# Altium project filament-width-sensor.PrjPcb
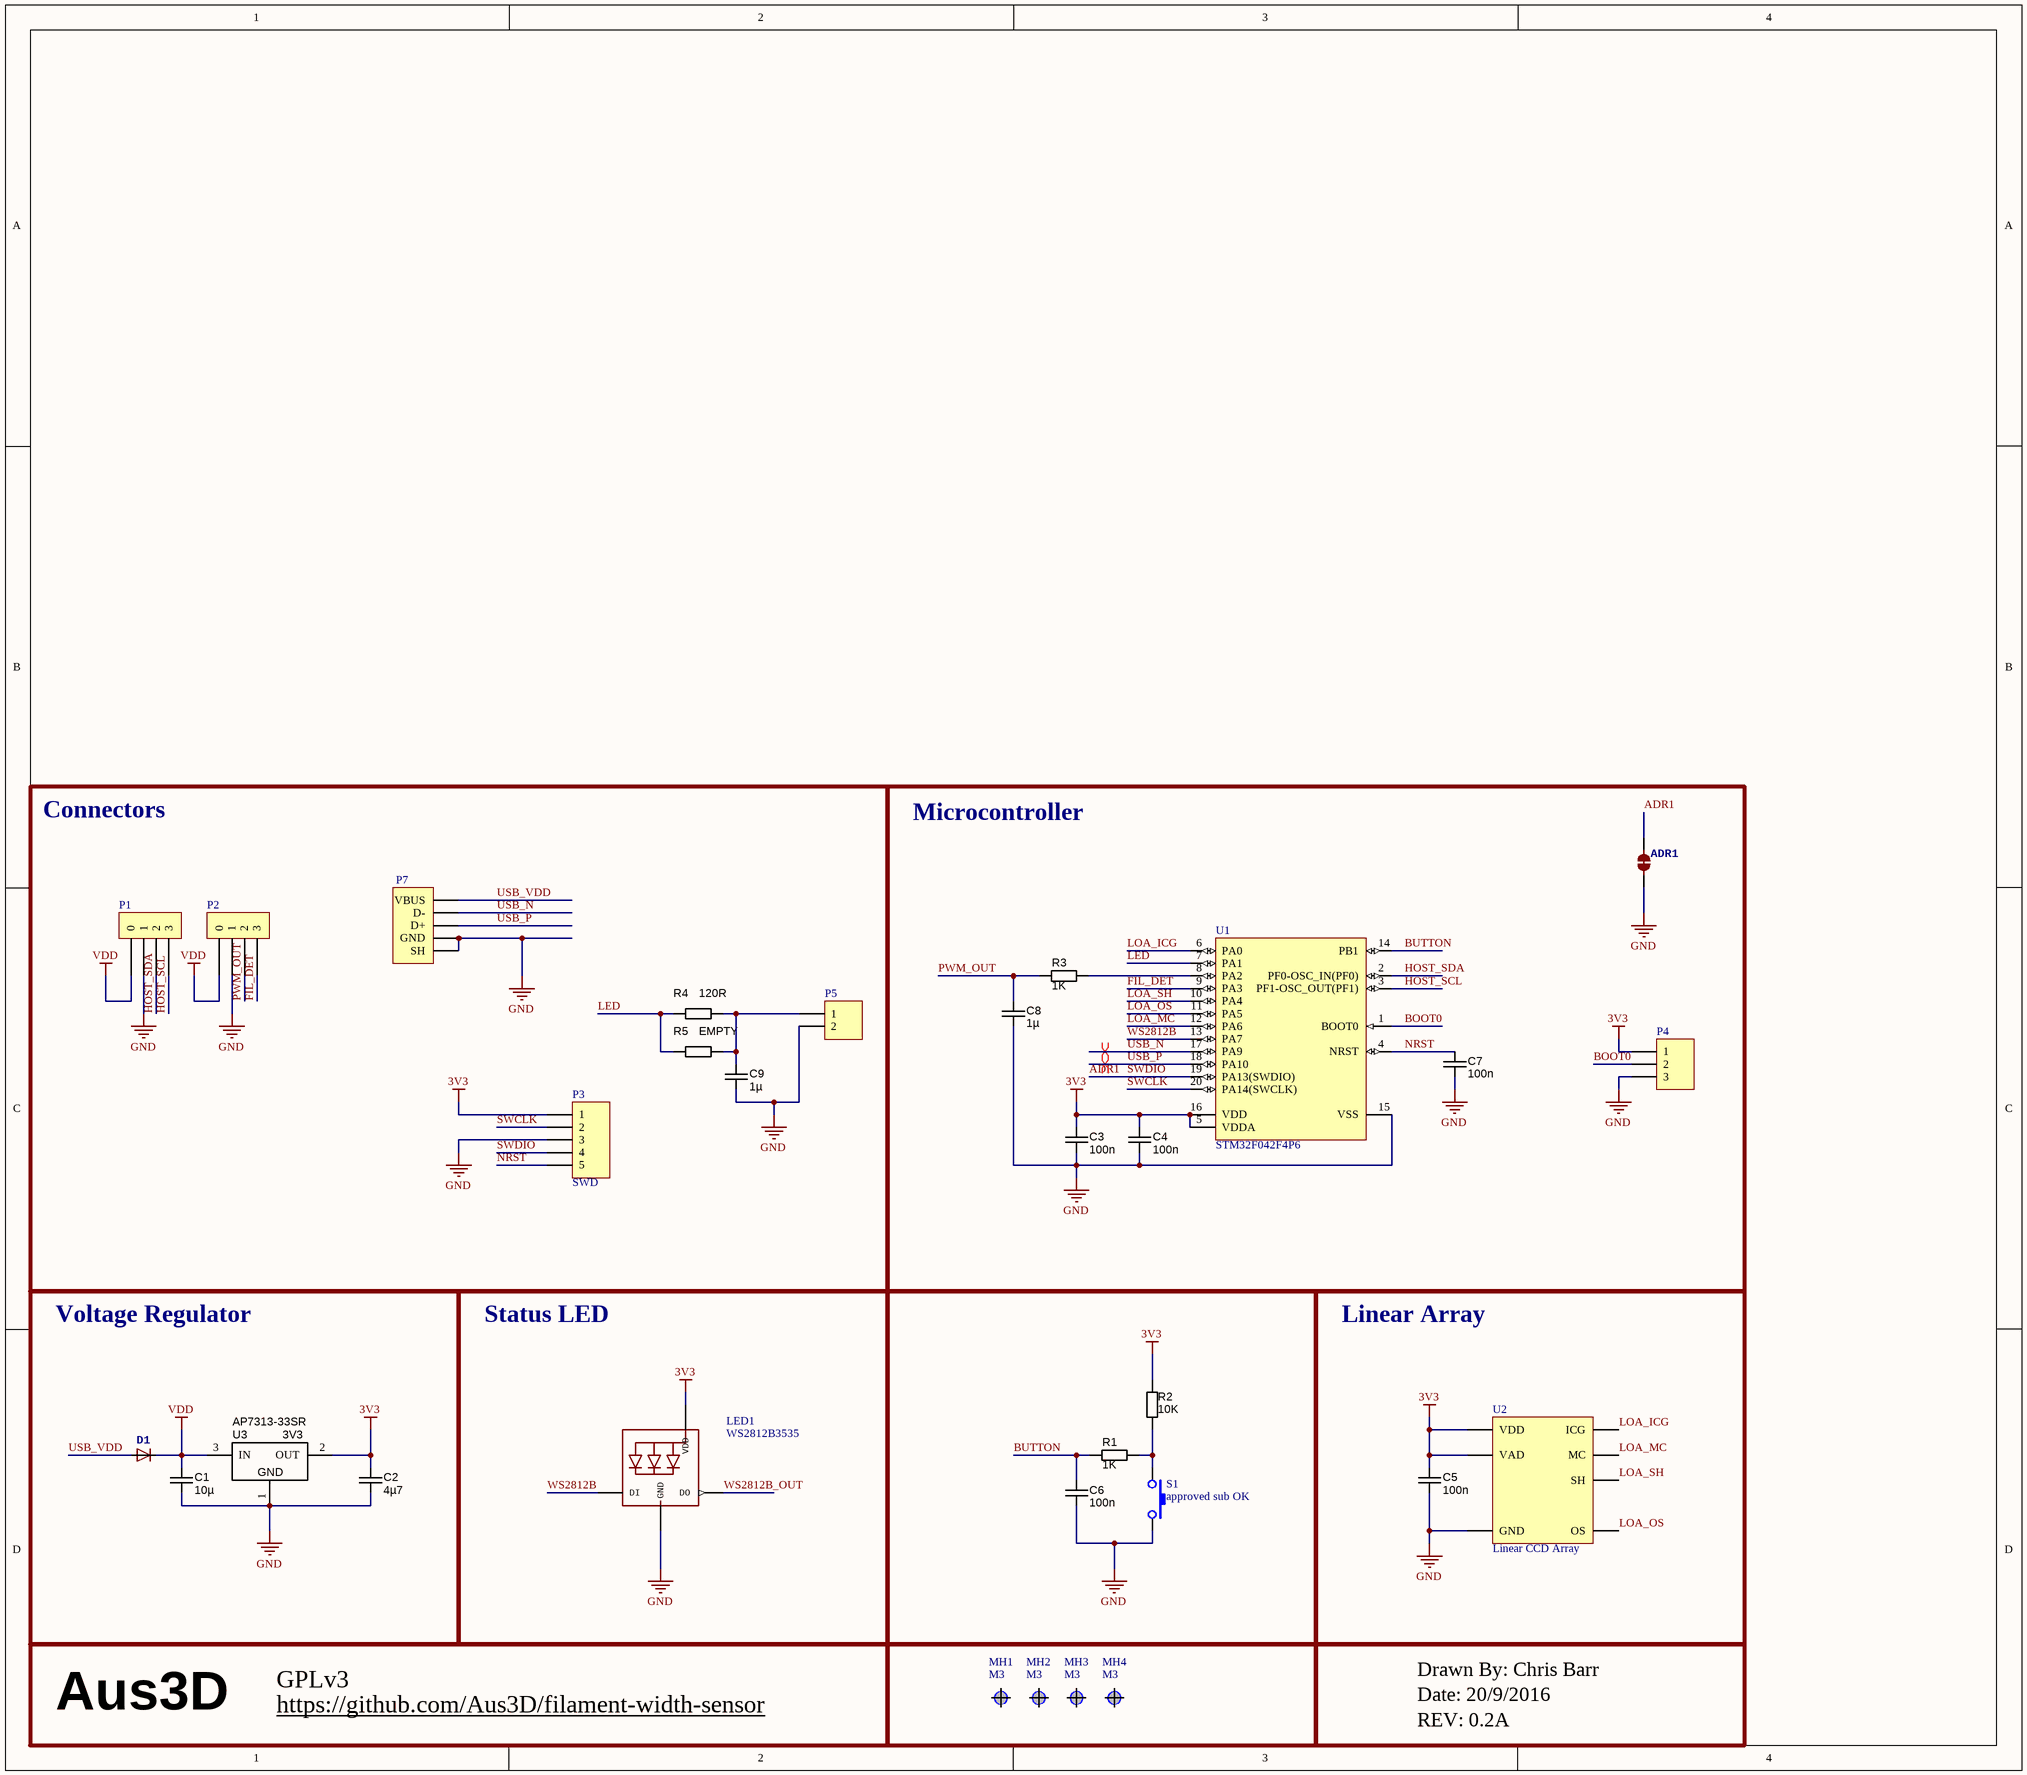
[diagram p0: filament-width-sensor.SchDoc]
1 sheet, 31 parts. Net scope: global (net labels, ports and power ports of the same name join across sheets).
Board file: filament-width-sensor.PcbDoc

## Sheet filament-width-sensor.SchDoc
size 406 x 355 mm

### Parts
ADR1  JUMPER-PAD-2-NC_BY_TRACE  [PAD-JUMPER-2-NC_BY_TRACE_YES_SILK]  (value not drawn)  (no BOM)
C1  value 10µ  [CAPC2012X135N]  (hidden comment: approved sub OK)
C2  value 4µ7  [CAPC2012X135N]  (hidden comment: approved sub OK)
C3  value 100n  [CAPC1608X90N]  (hidden comment: approved sub OK)
C4  value 100n  [CAPC1608X90N]  (hidden comment: approved sub OK)
C5  value 100n  [CAPC1608X90N]  (hidden comment: approved sub OK)
C6  value 100n  [CAPC1608X90N]  (hidden comment: approved sub OK)
C7  value 100n  [CAPC1608X90N]  (hidden comment: approved sub OK)
C8  value 1µ  [CAPC1608X90N]  (hidden comment: approved sub OK)
C9  value 1µ  [CAPC1608X90N]  (hidden comment: approved sub OK)
D1  approved sub OK  [SOT23-R]  (value not drawn)
LED1  WS2812B3535  [LED3535]
MH1  M3  [M3-Hole-2]  (no BOM)
MH2  M3  [M3-Hole-2]  (no BOM)
MH3  M3  [M3-Hole-2]  (no BOM)
MH4  M3  [M3-Hole-2]  (no BOM)
P1  approved sub OK  [SM04B-SRSS-TB]  (value not drawn)
P2  approved sub OK  [SM04B-SRSS-TB]  (value not drawn)
P3  SWD  [HDR1X5]  (no BOM)
P4  approved sub OK  [HDR1X3]  (value not drawn)
P5  approved sub OK  [HDR1X2]  (value not drawn)
P7  approved sub OK  [Micro-USB B Molex 105017-0001]  (value not drawn)
R1  value 1K  [RESC1608X55N]  (hidden comment: Thick Film)
R2  value 10K  [RESC1608X55N]  (hidden comment: Thick Film)
R3  value 1K  [RESC1608X55N]  (hidden comment: Thick Film)
R4  value 120R  [RESC1608X55N]  (hidden comment: Thick Film)
R5  value EMPTY  [RESC1608X55N]  (hidden comment: RES_EMPTY_0603)  (no BOM)
S1  approved sub OK  [SW-PB SMD 2pin]
U1  STM32F042F4P6  [STM-TSSOP20_N]
U2  Linear CCD Array  [TCD1304AP Linear CCD]
U3  AP7313-33SR  value 3V3  [SOT23-3]

### Blocks framed on the sheet
Connectors: C9 P1-P3 P5 P7 R4 R5
Microcontroller: ADR1 C3 C4 C7 C8 P4 R3 U1
Voltage Regulator: C1 C2 D1 U3
Status LED: LED1
Linear Array: C5 U2

### Nets
3V3: C2.1 C3.1 C4.1 C5.1 LED1.2(VDD) P3.1 P4.1 R2.1 U1.5(VDDA) U1.16(VDD) U2.VAD U2.VDD U3.2(OUT)
GND: ADR1.1 C1.2 C2.2 C3.2 C4.2 C5.2 C6.2 C7.2 C8.2 C9.2 LED1.4(GND) P1.1 P2.1 P3.3 P4.3 P5.2 P7.GND P7.SHIELD(SH) S1.2 U1.15(VSS) U2.GND U3.1(GND)
VDD: C1.1 D1.3(C) P1.0 P2.0 U3.3(IN)
ADR1: ADR1.2 P3.4 U1.19(PA13(SWDIO))  [also labelled SWDIO]
BOOT0: P4.2 U1.1(BOOT0)
BUTTON: C6.1 R1.1 U1.14(PB1)
FIL_DET: P2.3 U1.9(PA3)
HOST_SCL: P1.3 U1.3(PF1-OSC_OUT(PF1))
HOST_SDA: P1.2 U1.2(PF0-OSC_IN(PF0))
LED: R4.1 R5.1 U1.7(PA1)
LOA_ICG: U1.6(PA0) U2.ICG
LOA_MC: U1.12(PA6) U2.MC
LOA_OS: U1.11(PA5) U2.OS
LOA_SH: U1.10(PA4) U2.SH
NRST: C7.1 P3.5 U1.4(NRST)
PWM_OUT: C8.1 P2.2 R3.1
SWCLK: P3.2 U1.20(PA14(SWCLK))
USB_N: P7.D- U1.17(PA9)
USB_P: P7.D+ U1.18(PA10)
USB_VDD: D1.1(A) P7.VBUS
WS2812B: LED1.1(DI) U1.13(PA7)
WS2812B_OUT: LED1.3(DO)
NetC9_1: C9.1 P5.1 R4.2 R5.2
NetR1_2: R1.2 R2.2 S1.1
NetR3_2: R3.2 U1.8(PA2)

Not connected (* = marked no-connect by the designer): MH1 M3(0); MH2 M3(0); MH3 M3(0); MH4 M3(0)

### Layout directives
differential pair: USB_N, USB_P

### Notes on the sheet
- Aus3D
- https://github.com/Aus3D/filament-width-sensor
- GPLv3
- Drawn By: Chris Barr
- Date: 20/9/2016
- REV: 0.2A

### Library data of the parts
C1 = CAPC_10u_0805_10V: Capacitor SMD Cer 10uF 10% 10V X5R 0805; Manufacturer 1: AVX Corporation; Manufacturer Part Number 1: 0805ZD106KAT2A; Ratings: 10V; X5R; Material: ceramic; SCDType: spec; Package / Case: 0805 (2012 metric); Tolerance: ±10%; Manufacturer 2: Kemet; Manufacturer Part Number 2: C0805C106K8PACTU; Supplier 1: Digi-Key; Supplier Part Number 1: 478-5167-1-ND; ComponentLink1URL: http://www.avx.com/docs/Catalogs/cx5r.pdf; ComponentLink1Description: http://www.avx.com/docs/Catalogs/cx5r.pdf; ComponentLink2URL: http://www.kemet.com/datasheets&C0805C106K8PACTU; ComponentLink2Description: http://www.kemet.com/datasheets&C0805C106K8PACTU; Supplier 2: Digi-Key; Supplier Part Number 2: 399-4925-1-ND
C2 = CAPC_4u7_0805: Capacitor SMD Cer 4.7uF 10% 16V X5R 0805; Manufacturer 1: Taiyo Yuden; Manufacturer Part Number 1: EMK212BJ475KG-T; Ratings: 16V; X5R; Material: ceramic; SCDType: spec; Package / Case: 0805 (2012 Metric); Tolerance: ±10%; Supplier 1: Digi-Key; Supplier Part Number 1: 587-1294-1-ND; Operating Temperature: -55°C ~ 85°C; Size / Dimension: 0.079" L x 0.049" W (2.00mm x 1.25mm); Thickness (Max): 0.053" (1.35mm); ComponentLink1URL: http://www.yuden.co.jp/productdata/catalog/en/mlcc01_e.pdf; ComponentLink1Description: http://www.yuden.co.jp/productdata/catalog/en/mlcc01_e.pdf; Supplier 2: Digi-Key; Supplier Part Number 2: 1276-1065-1-ND; Manufacturer 2: Samsung Electro-Mechanics America, Inc; Manufacturer Part Number 2: CL21A475KOFNNNE; RoHS 2: RoHS Compliant; ComponentLink2URL: http://www.samsungsem.com/servlet/FileDownload?type=spec&file=CL21A475KOFNNNE.pdf; ComponentLink2Description: http://www.samsungsem.com/servlet/FileDownload?type=spec&file=CL21A475KOFNNNE.pdf; Supplier 3: Digi-Key; Supplier Part Number 3: 399-8101-1-ND; Manufacturer 3: Kemet; Manufacturer Part Number 3: C0805C475K4PACTU; RoHS 3: RoHS Compliant; ComponentLink3URL: http://capacitoredge.kemet.com/capedge2/DataSheet?pn=C0805C475K4PACTU; ComponentLink3Description: http://capacitoredge.kemet.com/capedge2/DataSheet?pn=C0805C475K4PACTU; Supplier 4: Digi-Key; Supplier Part Number 4: 490-7215-1-ND; Manufacturer 4: Murata Electronics North America; Manufacturer Part Number 4: GRM21BR61C475MA88L; RoHS 4: RoHS Compliant; ComponentLink4URL: http://psearch.murata.com/capacitor/product/GRM21BR61C475MA88#.pdf; ComponentLink4Description: http://psearch.murata.com/capacitor/product/GRM21BR61C475MA88#.pdf; Supplier 5: Digi-Key; Supplier Part Number 5: 445-7640-1-ND; Manufacturer 5: TDK Corporation; Manufacturer Part Number 5: C2012X5R1C475K125AC; RoHS 5: RoHS Compliant; ComponentLink5URL: http://product.tdk.com/capacitor/mlcc/en/documents/mlcc_commercial_general_en.pdf; ComponentLink5Description: http://product.tdk.com/capacitor/mlcc/en/documents/mlcc_commercial_general_en.pdf; RoHS 1: RoHS Compliant
C3-C7 = CAPC_100n_0603_X7R_50V_10%: Capacitor SMD Cer 100nF 10% 50V X7R 0603; Manufacturer 1: AVX Corporation; Manufacturer Part Number 1: 06035C104KAT2A; Ratings: 50V; X7R; Material: ceramic; SCDType: spec; Manufacturer 2: TDK Corporation; Manufacturer Part Number 2: C1608X7R1H104K; Package / Case: 0603 (1608 Metric); Tolerance: ±10%; Supplier 1: Digi-Key; Supplier Part Number 1: 478-5052-1-ND; ComponentLink1URL: http://www.avx.com/docs/Catalogs/cx7r.pdf; ComponentLink1Description: http://www.avx.com/docs/Catalogs/cx7r.pdf; Supplier 2: Digi-Key; Supplier Part Number 2: 445-1314-1-ND; ComponentLink2URL: http://product.tdk.com/capacitor/mlcc/en/documents/mlcc_commercial_general_en.pdf; ComponentLink2Description: http://product.tdk.com/capacitor/mlcc/en/documents/mlcc_commercial_general_en.pdf
C8 C9 = CAPC_1u_0603_X7R_16V_10%: Capacitor SMD Cer 1uF 10% 16V X7R 0603; Manufacturer 1: TDK Corporation; Manufacturer Part Number 1: C1608X7R1C105K; Ratings: 16V; X7R; Material: ceramic; SCDType: spec; Package / Case: 0603 (1608 metric); Tolerance: ±10%; Supplier 1: Digi-Key; Supplier Part Number 1: 445-1604-1-ND; ComponentLink1URL: http://product.tdk.com/capacitor/mlcc/en/documents/mlcc_commercial_general_en.pdf; ComponentLink1Description: http://product.tdk.com/capacitor/mlcc/en/documents/mlcc_commercial_general_en.pdf
D1 = DIODESOT23_REFLOW: Diode SMA; Manufacturer Part Number 1: BAS116,215; Manufacturer 1: NXP-Semiconductors; Supplier Part Number 1: 568-5994-1-ND; Supplier 1: Digi-Key
LED1 = WS2812B3535: Smart RGB LED; Manufacturer 1: DONGGUANG OPSCO OPTOELECTRONICS CO., LTD; Manufacturer Part Number 1: SK6812MINI
MH1-MH4 = Screw Hole
P1 P2 = SM04B-SRSS-TB: JST-SH 4-pin; Supplier 1: Digi-Key; Supplier Part Number 1: 455-1804-1-ND
P3 = Header 5: Header, 5-Pin; LatestRevisionDate: 17-Jul-2002; LatestRevisionNote: Re-released for DXP Platform.; Publisher: Altium Limited
P4 = Header 3: Header, 3-Pin; LatestRevisionDate: 17-Jul-2002; LatestRevisionNote: Re-released for DXP Platform.; Publisher: Altium Limited
P5 = Header 2: Header, 2-Pin; LatestRevisionDate: 17-Jul-2002; LatestRevisionNote: Re-released for DXP Platform.; Publisher: Altium Limited
P7 = Micro-USB B Socket: Supplier 1: Digi-Key; Supplier Part Number 1: WM1399CT-ND
R1 R3 = RES_1K_0603_5%: Resistor SMD chip 1k Ohm 0.1W 5% 0603; Manufacturer 1: Yageo; Manufacturer Part Number 1: RC0603JR-071KL; Ratings: 1/10 W; SCDType: spec; Package / Case: 0603 (1608 metric); Tolerance: ±5%; Material: Thick Film; Supplier 1: Digi-Key; Supplier Part Number 1: 311-1.0KGRCT-ND; Supplier 2: Digi-Key; Supplier Part Number 2: 541-1.0KGCT-ND; Manufacturer 2: Vishay Dale; Manufacturer Part Number 2: CRCW06031K00JNEA; ComponentLink2URL: http://www.vishay.com/doc?20008; ComponentLink2Description: http://www.vishay.com/doc?20008; ComponentLink1URL: http://www.yageo.com/documents/recent/PYu-RC0603_51_RoHS_L_4.pdf; ComponentLink1Description: http://www.yageo.com/documents/recent/PYu-RC0603_51_RoHS_L_4.pdf
R2 = RES_10K_0603_5%: Resistor SMD chip 10k Ohm 0.1W 5% 0603; Manufacturer 1: Yageo; Manufacturer Part Number 1: RC0603JR-0710KL; Ratings: 1/10 W; SCDType: spec; Package / Case: 0603 (1608 metric); Tolerance: ±5%; Material: Thick Film; Supplier 1: Digi-Key; Supplier Part Number 1: 311-10KGRCT-ND; Supplier 2: Digi-Key; Supplier Part Number 2: 541-10KGCT-ND; Manufacturer 2: Vishay Dale; Manufacturer Part Number 2: CRCW060310K0JNEA; ComponentLink2URL: http://www.vishay.com/doc?20035; ComponentLink2Description: http://www.vishay.com/doc?20035; ComponentLink1URL: http://www.yageo.com/documents/recent/PYu-RC0603_51_RoHS_L_4.pdf; ComponentLink1Description: http://www.yageo.com/documents/recent/PYu-RC0603_51_RoHS_L_4.pdf
R4 = RES_120R_0603_5%: Resistor SMD chip 120 Ohm 0.1W 5% 0603; Manufacturer 1: Vishay Dale; Manufacturer Part Number 1: CRCW0603120RJNEA; Ratings: 1/10 W; SCDType: spec; Package / Case: 0603 (1608 metric); Tolerance: ±5%; Material: Thick Film; Supplier 1: Digi-Key; Supplier Part Number 1: 541-120GCT-ND; ComponentLink1URL: http://www.vishay.com/doc?20035; ComponentLink1Description: http://www.vishay.com/doc?20035; Supplier 2: Digi-Key; Supplier Part Number 2: 311-120GRCT-ND; Manufacturer 2: Yageo; Manufacturer Part Number 2: RC0603JR-07120RL; ComponentLink2URL: http://www.yageo.com/documents/recent/PYu-RC0603_51_RoHS_L_4.pdf; ComponentLink2Description: http://www.yageo.com/documents/recent/PYu-RC0603_51_RoHS_L_4.pdf
R5 = RES_EMPTY_0603: Resistor, 08603 SMD, Empty footprint; Package / Case: 0603 (1608metric)
S1 = SW-PB: SMD Button; Supplier 1: Digi-Key; Supplier Part Number 1: 679-2396-1-ND
U1 = STM32F030F4P6: ARM Cortex-M0 32-bit MCU, 16 KB Flash, 4 KB Internal RAM, 15 I/Os, 20-pin TSSOP, -40 to 85 degC, Tube; FLASH Size (Prog) (kB): 16; I/Os (High Current): 15; Internal RAM Size (kB): 4; Operating Frequency(F) (Processor speed) (MHz): 48; Supply Voltage(Vcc) min (V): 2.4; DatasheetVersion: Rev. 1; PackageVersion: Rev. 1, 11/2012; PackageReference: TSSOP20; PackageDescription: 20-Pin Thin Shrink Small Outline Package, 6.5 x 4.4 mm Body, 0.65 mm Pitch; Supplier 1: Digi-Key; Supplier Part Number 1: STM32F042F4P6-ND; Supplier 2: Newark; Supplier Part Number 2: 06X3648; Supplier 3: Mouser; Supplier Part Number 3: 511-STM32F042F4P6; Core: ARM Cortex-M0; Packing: Tube; Mounting Technology: Surface Mount; PartNumber: STM32F042F4P6; ComponentLink1Description: Manufacturer URL; ComponentLink1URL: http://www.st.com/web/en/home.html; ComponentLink2Description: Datasheet; ComponentLink2URL: http://www.st.com/st-web-ui/static/active/en/resource/technical/document/datasheet/DM00088500.pdf; ComponentLink3Description: Package Specification; ComponentLink3URL: http://www.st.com/st-web-ui/static/active/en/resource/technical/document/datasheet/DM00065136.pdf
U2 = TCD1304AP: Toshiba CCD Array TCD1304AP; Manufacturer 1: Toshiba; Manufacturer Part Number 1: TCD1304AP
U3 = VREG_3V3_AP7313-33SR: Voltage Regulator 3.3V LDO SOT23R-3 SMD; Manufacturer 1: Diodes Inc; Manufacturer Part Number 1: AP7313-33SRG-7; Voltage Regulator Type: Low Drop-Out (LDO); Tolerance: ±2%; Ratings: 6Vin; 150mA; SCDType: source; Package / Case: SOT23R-3; Supplier 1: Digi-Key; Supplier Part Number 1: AP7313-33SRG-7DICT-ND; ComponentLink1URL: http://www.diodes.com/datasheets/AP7313.pdf; ComponentLink1Description: AP7313 datasheet